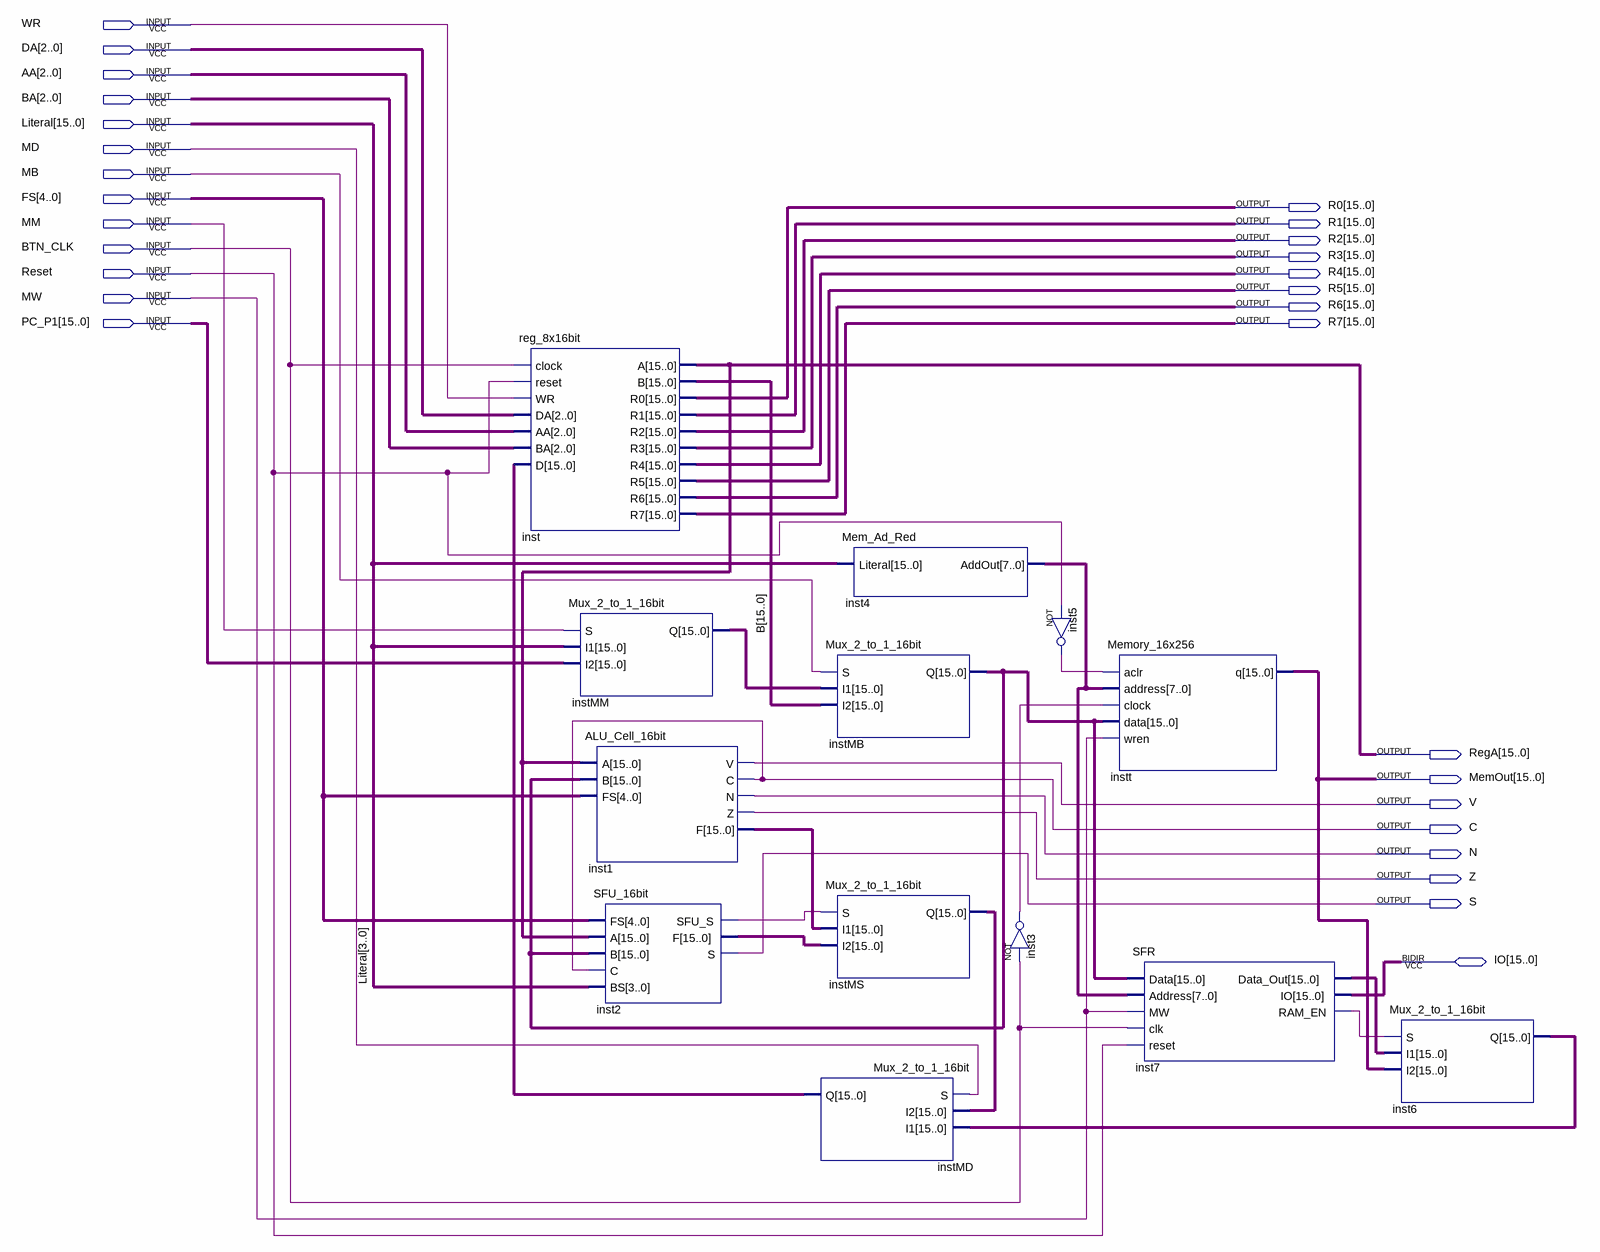
[diagram p0: schematic sheet]
// Quartus schematic Datapath.bdf as structural Verilog: 13 symbols, 29 pins
module Datapath (
  input  WR,
  input  [2:0] DA,
  input  [2:0] AA,
  input  [2:0] BA,
  input  [15:0] Literal,
  input  MD,
  input  MB,
  input  [4:0] FS,
  input  MM,
  input  BTN_CLK,
  input  Reset,
  input  MW,
  input  [15:0] PC_P1,
  inout  [15:0] IO,
  output [15:0] R0,
  output [15:0] R1,
  output [15:0] R2,
  output [15:0] R3,
  output [15:0] R4,
  output [15:0] R5,
  output [15:0] R6,
  output [15:0] R7,
  output [15:0] RegA,
  output [15:0] MemOut,
  output V,
  output C,
  output N,
  output Z,
  output S
);

  wire inst2_sfu_s, inst3_out, inst5_out, inst7_ram_en;
  wire [7:0] inst4_addout;
  wire [15:0] B, inst1_f, inst2_f, inst6_q, inst7_data_out, instMB_q, instMD_q, instMM_q, instMS_q;

  reg_8x16bit inst (
    .clock(BTN_CLK), .WR(WR), .reset(Reset), .AA(AA), .BA(BA), .D(instMD_q), .DA(DA), .A(RegA), .B(B),
    .R0(R0), .R1(R1), .R2(R2), .R3(R3), .R4(R4), .R5(R5), .R6(R6), .R7(R7));
  Mux_2_to_1_16bit instMM (.S(MM), .I1(Literal), .I2(PC_P1), .Q(instMM_q));
  ALU_Cell_16bit inst1 (.A(RegA), .B(instMB_q), .FS(FS), .Z(Z), .C(C), .N(N), .V(V), .F(inst1_f));
  SFU_16bit inst2 (.FS(FS), .A(RegA), .B(instMB_q), .C(C), .BS(Literal[3:0]), .F(inst2_f), .SFU_S(inst2_sfu_s), .S(S));
  Mem_Ad_Red inst4 (.Literal(Literal), .AddOut(inst4_addout));
  Mux_2_to_1_16bit instMB (.S(MB), .I1(instMM_q), .I2(B), .Q(instMB_q));
  Mux_2_to_1_16bit instMS (.S(inst2_sfu_s), .I1(inst1_f), .I2(inst2_f), .Q(instMS_q));
  Mux_2_to_1_16bit instMD (.S(MD), .I2(instMS_q), .I1(inst6_q), .Q(instMD_q));
  not inst5 (inst5_out, Reset);
  not inst3 (inst3_out, BTN_CLK);
  Memory_16x256 instt (
    .aclr(inst5_out), .address(inst4_addout), .clock(inst3_out), .data(instMB_q), .wren(MW), .q(MemOut));
  SFR inst7 (
    .Data(instMB_q), .Address(inst4_addout), .MW(MW), .clk(BTN_CLK), .reset(Reset),
    .Data_Out(inst7_data_out), .RAM_EN(inst7_ram_en), .IO(IO));
  Mux_2_to_1_16bit inst6 (.S(inst7_ram_en), .I1(inst7_data_out), .I2(MemOut), .Q(inst6_q));
endmodule
